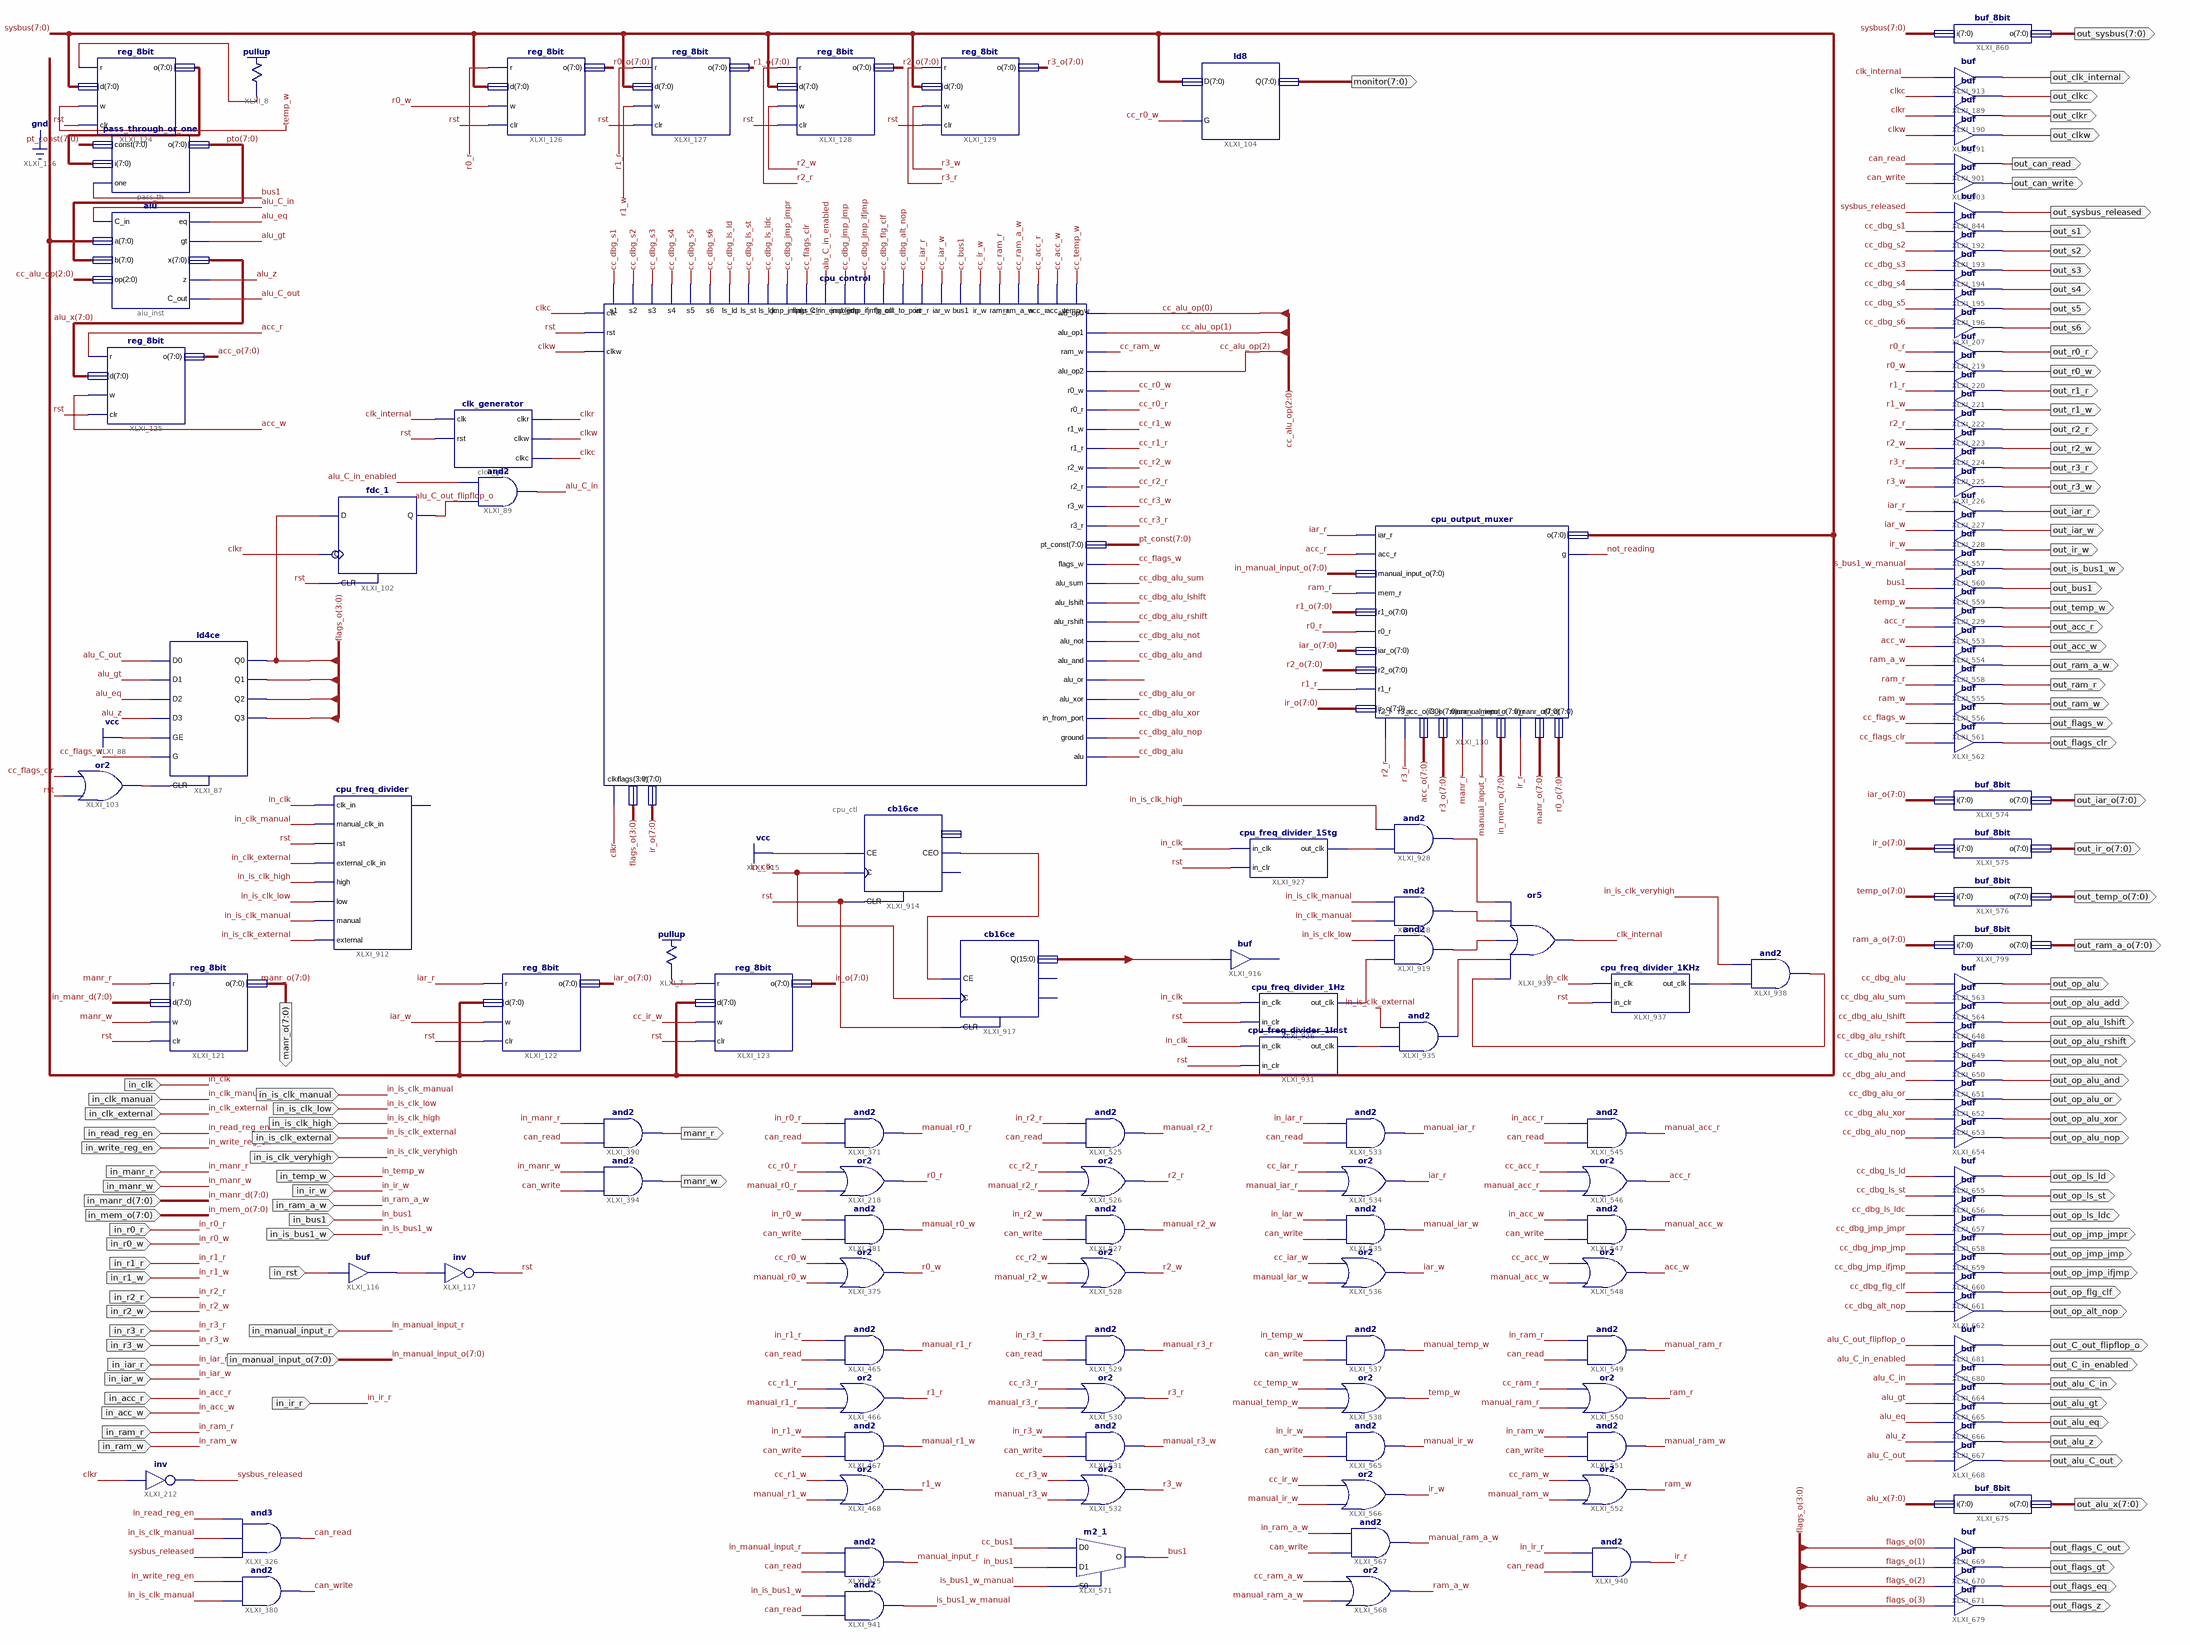
[diagram p0: schematic sheet 1]
// Xilinx ISE schematic cpu.sch (aspartan6) as structural Verilog: 148 symbols, 109 ports
module cpu (
  input  [7:0] in_manr_d,
  input  in_is_clk_high,
  input  in_is_clk_low,
  input  in_is_clk_external,
  input  in_r0_r,
  input  in_read_reg_en,
  input  in_write_reg_en,
  input  in_manr_r,
  input  in_r0_w,
  input  in_manr_w,
  input  in_r1_r,
  input  in_r1_w,
  input  in_r2_r,
  input  in_r2_w,
  input  in_r3_r,
  input  in_r3_w,
  input  in_iar_r,
  input  in_iar_w,
  input  in_temp_w,
  input  in_acc_r,
  input  in_acc_w,
  input  in_ram_r,
  input  in_ram_w,
  input  in_ir_w,
  input  in_ram_a_w,
  input  in_bus1,
  input  in_is_bus1_w,
  input  in_clk,
  input  in_clk_manual,
  input  in_clk_external,
  input  in_rst,
  input  in_is_clk_manual,
  input  in_manual_input_r,
  input  [7:0] in_manual_input_o,
  input  in_ir_r,
  input  in_is_clk_veryhigh,
  input  [7:0] in_mem_o,
  output [7:0] monitor,
  output [7:0] manr_o,
  output manr_w,
  output manr_r,
  output out_op_alu_add,
  output out_op_alu,
  output out_op_alu_lshift,
  output out_op_alu_rshift,
  output out_op_alu_and,
  output out_op_alu_xor,
  output out_op_alu_not,
  output out_op_alu_or,
  output out_op_alu_nop,
  output out_op_ls_st,
  output out_op_ls_ld,
  output out_op_ls_ldc,
  output out_op_jmp_jmpr,
  output out_op_jmp_ifjmp,
  output out_op_jmp_jmp,
  output out_op_flg_clf,
  output out_op_alt_nop,
  output out_alu_gt,
  output out_alu_C_in,
  output out_alu_z,
  output out_alu_C_out,
  output [7:0] out_alu_x,
  output out_alu_eq,
  output out_flags_C_out,
  output out_flags_gt,
  output out_flags_eq,
  output out_flags_z,
  output out_C_in_enabled,
  output out_C_out_flipflop_o,
  output [7:0] out_iar_o,
  output [7:0] out_temp_o,
  output [7:0] out_ir_o,
  output [7:0] out_sysbus,
  output [7:0] out_ram_a_o,
  output out_clkc,
  output out_clkr,
  output out_clkw,
  output out_iar_w,
  output out_iar_r,
  output out_flags_w,
  output out_flags_clr,
  output out_s1,
  output out_s2,
  output out_s4,
  output out_s6,
  output out_s3,
  output out_s5,
  output out_sysbus_released,
  output out_r0_r,
  output out_r0_w,
  output out_r1_r,
  output out_r1_w,
  output out_r2_r,
  output out_r2_w,
  output out_r3_r,
  output out_r3_w,
  output out_ir_w,
  output out_is_bus1_w,
  output out_bus1,
  output out_acc_w,
  output out_acc_r,
  output out_temp_w,
  output out_ram_w,
  output out_ram_r,
  output out_ram_a_w,
  output out_can_read,
  output out_can_write,
  output out_clk_internal
);

  wire acc_r, acc_w, alu_C_in, alu_C_in_enabled, alu_C_out, alu_C_out_flipflop_o, alu_eq, alu_gt, alu_z,
       bus1, can_read, can_write, cc_acc_r, cc_acc_w, cc_bus1, cc_dbg_alt_nop, cc_dbg_alu, cc_dbg_alu_and,
       cc_dbg_alu_lshift, cc_dbg_alu_nop, cc_dbg_alu_not, cc_dbg_alu_or, cc_dbg_alu_rshift, cc_dbg_alu_sum,
       cc_dbg_alu_xor, cc_dbg_flg_clf, cc_dbg_jmp_ifjmp, cc_dbg_jmp_jmp, cc_dbg_jmp_jmpr, cc_dbg_ls_ld,
       cc_dbg_ls_ldc, cc_dbg_ls_st, cc_dbg_s1, cc_dbg_s2, cc_dbg_s3, cc_dbg_s4, cc_dbg_s5, cc_dbg_s6,
       cc_flags_clr, cc_flags_w, cc_iar_r, cc_iar_w, cc_ir_w, cc_r0_r, cc_r0_w, cc_r1_r, cc_r1_w, cc_r2_r,
       cc_r2_w, cc_r3_r, cc_r3_w, cc_ram_a_w, cc_ram_r, cc_ram_w, cc_temp_w, clk_internal, clkc, clkr, clkw,
       ground, iar_r, iar_w, ir_r, ir_w, is_bus1_w_manual, manual_acc_r, manual_acc_w, manual_iar_r,
       manual_iar_w, manual_input_r, manual_ir_w, manual_r0_r, manual_r0_w, manual_r1_r, manual_r1_w,
       manual_r2_r, manual_r2_w, manual_r3_r, manual_r3_w, manual_ram_a_w, manual_ram_r, manual_ram_w,
       manual_temp_w, not_reading, r0_r, r0_w, r1_r, r1_w, r2_r, r2_w, r3_r, r3_w, ram_a_w, ram_r, ram_w,
       rst, sysbus_released, temp_r, temp_w, XLXN_23, XLXN_217, XLXN_233, XLXN_235, XLXN_247, XLXN_252,
       XLXN_255, XLXN_256, XLXN_262, XLXN_267, XLXN_272, XLXN_275, XLXN_278;
  wire [2:0] cc_alu_op;
  wire [3:0] flags_o;
  wire [7:0] acc_o, alu_x, iar_o, ir_o, pt_const, pto, r0_o, r1_o, r2_o, r3_o, ram_a_o, sysbus, temp_o;
  wire [15:0] freq_div_1;

  alu alu_inst (
    .a(sysbus), .b(pto), .C_in(alu_C_in), .C_out(alu_C_out), .eq(alu_eq), .gt(alu_gt), .op(cc_alu_op),
    .x(alu_x), .z(alu_z));
  \pullup  XLXI_8 (.O(temp_r));
  \pullup  XLXI_7 (.O(XLXN_23));
  ld4ce XLXI_87 (
    .CLR(XLXN_217), .D0(alu_C_out), .D1(alu_gt), .D2(alu_eq), .D3(alu_z), .G(cc_flags_w), .GE(1'b1),
    .Q0(flags_o[0]), .Q1(flags_o[1]), .Q2(flags_o[2]), .Q3(flags_o[3]));
  and XLXI_89 (alu_C_in, alu_C_out_flipflop_o, alu_C_in_enabled);
  or XLXI_103 (XLXN_217, rst, cc_flags_clr);
  ld8 XLXI_104 (.D(sysbus), .G(cc_r0_w), .Q(monitor));
  pass_through_or_one pass_th (.\const (pt_const), .i(temp_o), .o(pto), .one(bus1));
  reg_8bit XLXI_121 (.clr(rst), .d(in_manr_d), .o(manr_o), .r(manr_r), .w(manr_w));
  reg_8bit XLXI_122 (.clr(rst), .d(sysbus), .o(iar_o), .r(iar_r), .w(iar_w));
  reg_8bit XLXI_123 (.clr(rst), .d(sysbus), .o(ir_o), .r(XLXN_23), .w(cc_ir_w));
  reg_8bit XLXI_124 (.clr(rst), .d(sysbus), .o(temp_o), .r(temp_r), .w(temp_w));
  reg_8bit XLXI_125 (.clr(rst), .d(alu_x), .o(acc_o), .r(acc_r), .w(acc_w));
  reg_8bit XLXI_126 (.clr(rst), .d(sysbus), .o(r0_o), .r(r0_r), .w(r0_w));
  reg_8bit XLXI_127 (.clr(rst), .d(sysbus), .o(r1_o), .r(r1_r), .w(r1_w));
  reg_8bit XLXI_128 (.clr(rst), .d(sysbus), .o(r2_o), .r(r2_r), .w(r2_w));
  reg_8bit XLXI_129 (.clr(rst), .d(sysbus), .o(r3_o), .r(r3_r), .w(r3_w));
  cpu_output_muxer XLXI_130 (
    .acc_o(acc_o), .acc_r(acc_r), .g(not_reading), .iar_o(iar_o), .iar_r(iar_r), .ir_o(ir_o), .ir_r(ir_r),
    .manr_o(manr_o), .manr_r(manr_r), .manual_input_o(in_manual_input_o), .manual_input_r(manual_input_r),
    .mem_o(in_mem_o), .mem_r(ram_r), .o(sysbus), .r0_o(r0_o), .r0_r(r0_r), .r1_o(r1_o), .r1_r(r1_r),
    .r2_o(r2_o), .r2_r(r2_r), .r3_o(r3_o), .r3_r(r3_r));
  fdc_1 XLXI_102 (.C(clkr), .CLR(rst), .D(flags_o[0]), .Q(alu_C_out_flipflop_o));
  clk_generator clck_gen (.clk(clk_internal), .clkc(clkc), .clkr(clkr), .clkw(clkw), .rst(rst));
  and XLXI_390 (manr_r, can_read, in_manr_r);
  and XLXI_394 (manr_w, can_write, in_manr_w);
  and XLXI_371 (manual_r0_r, can_read, in_r0_r);
  or XLXI_218 (r0_r, manual_r0_r, cc_r0_r);
  and XLXI_381 (manual_r0_w, can_write, in_r0_w);
  or XLXI_375 (r0_w, manual_r0_w, cc_r0_w);
  and XLXI_465 (manual_r1_r, can_read, in_r1_r);
  or XLXI_466 (r1_r, manual_r1_r, cc_r1_r);
  and XLXI_467 (manual_r1_w, can_write, in_r1_w);
  or XLXI_468 (r1_w, manual_r1_w, cc_r1_w);
  and XLXI_380 (can_write, in_is_clk_manual, in_write_reg_en);
  and XLXI_525 (manual_r2_r, can_read, in_r2_r);
  or XLXI_526 (r2_r, manual_r2_r, cc_r2_r);
  and XLXI_527 (manual_r2_w, can_write, in_r2_w);
  or XLXI_528 (r2_w, manual_r2_w, cc_r2_w);
  and XLXI_529 (manual_r3_r, can_read, in_r3_r);
  or XLXI_530 (r3_r, manual_r3_r, cc_r3_r);
  and XLXI_531 (manual_r3_w, can_write, in_r3_w);
  or XLXI_532 (r3_w, manual_r3_w, cc_r3_w);
  and XLXI_533 (manual_iar_r, can_read, in_iar_r);
  or XLXI_534 (iar_r, manual_iar_r, cc_iar_r);
  and XLXI_535 (manual_iar_w, can_write, in_iar_w);
  or XLXI_536 (iar_w, manual_iar_w, cc_iar_w);
  and XLXI_537 (manual_temp_w, can_write, in_temp_w);
  or XLXI_538 (temp_w, manual_temp_w, cc_temp_w);
  and XLXI_326 (can_read, sysbus_released, in_is_clk_manual, in_read_reg_en);
  not XLXI_212 (sysbus_released, clkr);
  and XLXI_545 (manual_acc_r, can_read, in_acc_r);
  or XLXI_546 (acc_r, manual_acc_r, cc_acc_r);
  and XLXI_547 (manual_acc_w, can_write, in_acc_w);
  or XLXI_548 (acc_w, manual_acc_w, cc_acc_w);
  and XLXI_549 (manual_ram_r, can_read, in_ram_r);
  or XLXI_550 (ram_r, manual_ram_r, cc_ram_r);
  and XLXI_551 (manual_ram_w, can_write, in_ram_w);
  or XLXI_552 (ram_w, manual_ram_w, cc_ram_w);
  and XLXI_565 (manual_ir_w, can_write, in_ir_w);
  or XLXI_566 (ir_w, manual_ir_w, cc_ir_w);
  and XLXI_567 (manual_ram_a_w, can_write, in_ram_a_w);
  or XLXI_568 (ram_a_w, manual_ram_a_w, cc_ram_a_w);
  m2_1 XLXI_571 (.D0(cc_bus1), .D1(in_bus1), .S0(is_bus1_w_manual), .O(bus1));
  buf XLXI_563 (out_op_alu, cc_dbg_alu);
  buf XLXI_564 (out_op_alu_add, cc_dbg_alu_sum);
  buf XLXI_648 (out_op_alu_lshift, cc_dbg_alu_lshift);
  buf XLXI_649 (out_op_alu_rshift, cc_dbg_alu_rshift);
  buf XLXI_650 (out_op_alu_not, cc_dbg_alu_not);
  buf XLXI_651 (out_op_alu_and, cc_dbg_alu_and);
  buf XLXI_652 (out_op_alu_or, cc_dbg_alu_or);
  buf XLXI_653 (out_op_alu_xor, cc_dbg_alu_xor);
  buf XLXI_654 (out_op_alu_nop, cc_dbg_alu_nop);
  buf XLXI_655 (out_op_ls_ld, cc_dbg_ls_ld);
  buf XLXI_656 (out_op_ls_st, cc_dbg_ls_st);
  buf XLXI_657 (out_op_ls_ldc, cc_dbg_ls_ldc);
  buf XLXI_658 (out_op_jmp_jmpr, cc_dbg_jmp_jmpr);
  buf XLXI_659 (out_op_jmp_jmp, cc_dbg_jmp_jmp);
  buf XLXI_660 (out_op_jmp_ifjmp, cc_dbg_jmp_ifjmp);
  buf XLXI_661 (out_op_flg_clf, cc_dbg_flg_clf);
  buf XLXI_662 (out_op_alt_nop, cc_dbg_alt_nop);
  buf XLXI_664 (out_alu_C_in, alu_C_in);
  buf XLXI_665 (out_alu_gt, alu_gt);
  buf XLXI_666 (out_alu_eq, alu_eq);
  buf XLXI_667 (out_alu_z, alu_z);
  buf XLXI_668 (out_alu_C_out, alu_C_out);
  buf_8bit XLXI_675 (.i(alu_x), .o(out_alu_x));
  buf XLXI_669 (out_flags_C_out, flags_o[0]);
  buf XLXI_670 (out_flags_gt, flags_o[1]);
  buf XLXI_671 (out_flags_eq, flags_o[2]);
  buf XLXI_679 (out_flags_z, flags_o[3]);
  buf XLXI_680 (out_C_in_enabled, alu_C_in_enabled);
  buf XLXI_681 (out_C_out_flipflop_o, alu_C_out_flipflop_o);
  buf_8bit XLXI_576 (.i(temp_o), .o(out_temp_o));
  buf_8bit XLXI_575 (.i(ir_o), .o(out_ir_o));
  buf_8bit XLXI_574 (.i(iar_o), .o(out_iar_o));
  buf_8bit XLXI_799 (.i(ram_a_o), .o(out_ram_a_o));
  buf XLXI_189 (out_clkc, clkc);
  buf XLXI_190 (out_clkr, clkr);
  buf XLXI_191 (out_clkw, clkw);
  buf_8bit XLXI_860 (.i(sysbus), .o(out_sysbus));
  buf XLXI_227 (out_iar_r, iar_r);
  buf XLXI_228 (out_iar_w, iar_w);
  buf XLXI_561 (out_flags_w, cc_flags_w);
  buf XLXI_562 (out_flags_clr, cc_flags_clr);
  buf XLXI_192 (out_s1, cc_dbg_s1);
  buf XLXI_193 (out_s2, cc_dbg_s2);
  buf XLXI_194 (out_s3, cc_dbg_s3);
  buf XLXI_195 (out_s4, cc_dbg_s4);
  buf XLXI_196 (out_s5, cc_dbg_s5);
  buf XLXI_207 (out_s6, cc_dbg_s6);
  buf XLXI_844 (out_sysbus_released, sysbus_released);
  buf XLXI_219 (out_r0_r, r0_r);
  buf XLXI_220 (out_r0_w, r0_w);
  buf XLXI_221 (out_r1_r, r1_r);
  buf XLXI_222 (out_r1_w, r1_w);
  buf XLXI_223 (out_r2_r, r2_r);
  buf XLXI_224 (out_r2_w, r2_w);
  buf XLXI_225 (out_r3_r, r3_r);
  buf XLXI_226 (out_r3_w, r3_w);
  buf XLXI_557 (out_ir_w, ir_w);
  buf XLXI_560 (out_is_bus1_w, is_bus1_w_manual);
  buf XLXI_559 (out_bus1, bus1);
  buf XLXI_554 (out_acc_w, acc_w);
  buf XLXI_553 (out_acc_r, acc_r);
  buf XLXI_229 (out_temp_w, temp_w);
  buf XLXI_555 (out_ram_r, ram_r);
  buf XLXI_556 (out_ram_w, ram_w);
  buf XLXI_558 (out_ram_a_w, ram_a_w);
  buf XLXI_901 (out_can_read, can_read);
  buf XLXI_903 (out_can_write, can_write);
  buf XLXI_116 (XLXN_233, in_rst);
  not XLXI_117 (rst, XLXN_233);
  buf XLXI_913 (out_clk_internal, clk_internal);
  cb16ce XLXI_914 (.C(in_clk), .CE(1'b1), .CLR(rst), .CEO(XLXN_235));  // open: Q, TC
  // buf XLXI_916 has open pins: I=freq_div_1[3], O=open
  cb16ce XLXI_917 (.C(in_clk), .CE(XLXN_235), .CLR(rst), .Q(freq_div_1));  // open: CEO, TC
  and XLXI_918 (XLXN_247, in_clk_manual, in_is_clk_manual);
  and XLXI_919 (XLXN_252, XLXN_255, in_is_clk_low);
  and XLXI_925 (manual_input_r, can_read, in_manual_input_r);
  cpu_freq_divider XLXI_912 (
    .clk_in(in_clk), .external(in_is_clk_external), .external_clk_in(in_clk_external), .high(in_is_clk_high),
    .low(in_is_clk_low), .manual(in_is_clk_manual), .manual_clk_in(in_clk_manual), .rst(rst));  // open: clk_out
  cpu_freq_divider_1Stg XLXI_927 (.in_clk(in_clk), .in_clr(rst), .out_clk(XLXN_256));
  and XLXI_928 (XLXN_262, XLXN_256, in_is_clk_high);
  cpu_freq_divider_1Hz XLXI_926 (.in_clk(in_clk), .in_clr(rst), .out_clk(XLXN_255));
  cpu_freq_divider_1Inst XLXI_931 (.in_clk(in_clk), .in_clr(rst), .out_clk(XLXN_267));
  and XLXI_935 (XLXN_272, XLXN_267, in_is_clk_external);
  cpu_freq_divider_1KHz XLXI_937 (.in_clk(in_clk), .in_clr(rst), .out_clk(XLXN_275));
  and XLXI_938 (XLXN_278, XLXN_275, in_is_clk_veryhigh);
  or XLXI_939 (clk_internal, XLXN_278, XLXN_272, XLXN_252, XLXN_247, XLXN_262);
  and XLXI_940 (ir_r, can_read, in_ir_r);
  and XLXI_941 (is_bus1_w_manual, can_read, in_is_bus1_w);
  cpu_control cpu_ctl (
    .acc_r(cc_acc_r), .acc_w(cc_acc_w), .alu(cc_dbg_alu), .alu_and(cc_dbg_alu_and),
    .alu_C_in_enabled(alu_C_in_enabled), .alu_lshift(cc_dbg_alu_lshift), .alu_not(cc_dbg_alu_not),
    .alu_op0(cc_alu_op[0]), .alu_op1(cc_alu_op[1]), .alu_op2(cc_alu_op[2]), .alu_or(ground),
    .alu_rshift(cc_dbg_alu_rshift), .alu_sum(cc_dbg_alu_sum), .alu_xor(cc_dbg_alu_or), .bus1(cc_bus1),
    .clk(clkc), .clkr(clkr), .clkw(clkw), .flags(flags_o), .flags_clr(cc_flags_clr), .flags_w(cc_flags_w),
    .flg_clf(cc_dbg_flg_clf), .ground(cc_dbg_alu_nop), .iar_r(cc_iar_r), .iar_w(cc_iar_w),
    .in_from_port(cc_dbg_alu_xor), .ir(ir_o), .ir_w(cc_ir_w), .jmp_ifjmp(cc_dbg_jmp_ifjmp),
    .jmp_jmp(cc_dbg_jmp_jmp), .jmp_jmpr(cc_dbg_jmp_jmpr), .ls_ld(cc_dbg_ls_ld), .ls_ldc(cc_dbg_ls_ldc),
    .ls_st(cc_dbg_ls_st), .out_to_port(cc_dbg_alt_nop), .pt_const(pt_const), .r0_r(cc_r0_r), .r0_w(cc_r0_w),
    .r1_r(cc_r1_r), .r1_w(cc_r1_w), .r2_r(cc_r2_r), .r2_w(cc_r2_w), .r3_r(cc_r3_r), .r3_w(cc_r3_w),
    .ram_a_w(cc_ram_a_w), .ram_r(cc_ram_r), .ram_w(cc_ram_w), .rst(rst), .s1(cc_dbg_s1), .s2(cc_dbg_s2),
    .s3(cc_dbg_s3), .s4(cc_dbg_s4), .s5(cc_dbg_s5), .s6(cc_dbg_s6), .temp_w(cc_temp_w));
endmodule
